# EAGLE design RadioMusic_F rev2-1 (EAGLE 9.0.1)
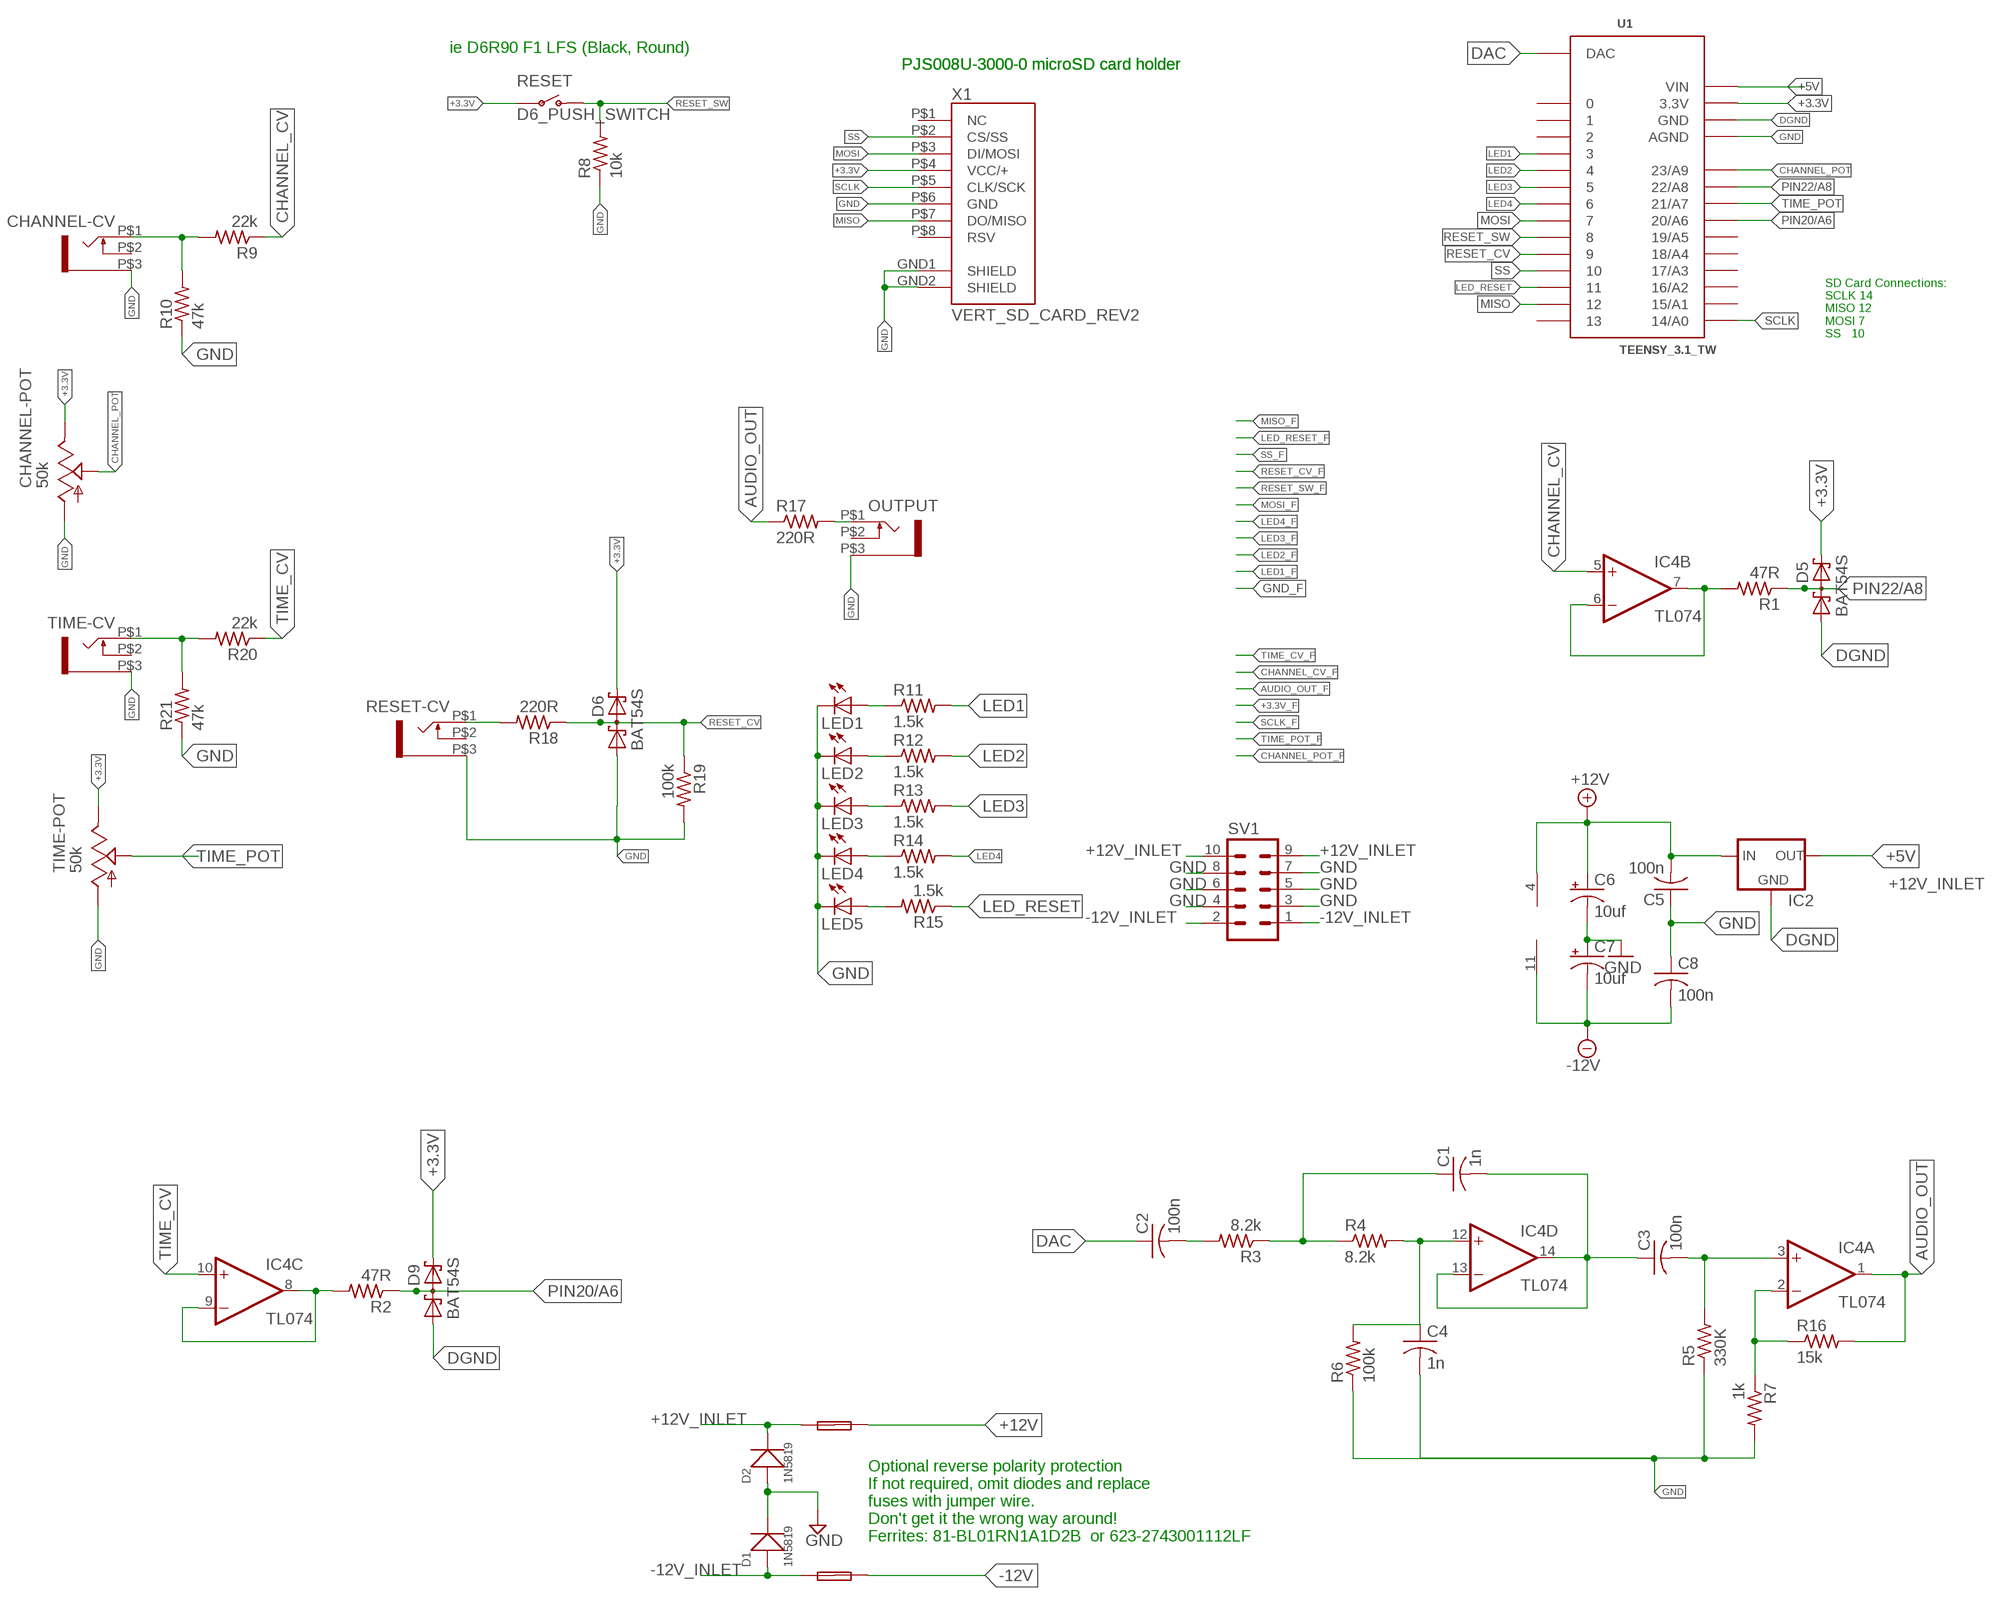
[diagram p0: schematic, sheet 1]

## Parts
C1  1n  C-USC0805  [C0805]
C2  100n  C-USC0805  [C0805]
C3  100n  C-USC0805  [C0805]
C4  1n  C-USC0805  [C0805]
C5  100n  C-USC0805  [C0805]
C6  10uf  CAP_POLPTH2  [CPOL-RADIAL-10UF-25V]
C7  10uf  CAP_POLPTH2  [CPOL-RADIAL-10UF-25V]
C8  100n  C-USC0805  [C0805]
CHANNEL-CV  WQP-PJ301M-12_JACK  [WQP-PJ301M-12_JACK]
CHANNEL-POT  50k  ALPHA-9MMF2A  [EVUF]
D1  1N5819  SMD-DIODE-SCHOTTKY-40V-500MA(SOD-123)  [SOD-123]
D2  1N5819  SMD-DIODE-SCHOTTKY-40V-500MA(SOD-123)  [SOD-123]
D5  BAT54S  [SOT23]
D6  BAT54S  [SOT23]
D9  BAT54S  [SOT23]
F1  FUSE  PTC_FUSEPOLY_FUSE  [C050H075X075]
F2  FUSE  PTC_FUSEPOLY_FUSE  [C050H075X075]
IC2  78LXX  [78LXX]
IC4  TL074  TL074D  [SO14]
LED1  LED3MM  [LED3MM]
LED2  LED3MM  [LED3MM]
LED3  LED3MM  [LED3MM]
LED4  LED3MM  [LED3MM]
LED5  LED3MM  [LED3MM]
OUTPUT  WQP-PJ301M-12_JACK  [WQP-PJ301M-12_JACK]
R1  47R  R-US_R0805  [R0805]
R2  47R  R-US_R0805  [R0805]
R3  8.2k  R-US_R0805  [R0805]
R4  8.2k  R-US_R0805  [R0805]
R5  330K  R-US_R0805  [R0805]
R6  100k  R-US_R0805  [R0805]
R7  1k  R-US_R0805  [R0805]
R8  10k  R-US_R0805  [R0805]
R9  22k  R-US_R0805  [R0805]
R10  47k  R-US_R0805  [R0805]
R11  1.5k  R-US_R0805  [R0805]
R12  1.5k  R-US_R0805  [R0805]
R13  1.5k  R-US_R0805  [R0805]
R14  1.5k  R-US_R0805  [R0805]
R15  1.5k  R-US_R0805  [R0805]
R16  15k  R-US_R0805  [R0805]
R17  220R  R-US_R0805  [R0805]
R18  220R  R-US_R0805  [R0805]
R19  100k  R-US_R0805  [R0805]
R20  22k  R-US_R0805  [R0805]
R21  47k  R-US_R0805  [R0805]
RESET  D6_PUSH_SWITCH  [D6_BUTTON_RND]
RESET-CV  WQP-PJ301M-12_JACK  [WQP-PJ301M-12_JACK]
SV1  10_PIN_HEADER  [MA05-2]
TIME-CV  WQP-PJ301M-12_JACK  [WQP-PJ301M-12_JACK]
TIME-POT  50k  ALPHA-9MMF2A  [EVUF]
U1  TEENSY_3.1_TW  [TEENSY_3.1_TW]
X1  VERT_SD_CARD_REV2  [VERT_MICROSD_REV2]

## Nets
+3.3V: CHANNEL-POT.3(E) D5.2(C2) D6.2(C2) D9.2(C2) RESET.P$3(P) RESET.P$4(P) TIME-POT.3(E) U1.3.3V X1.P$4(VCC/+)
+5V: IC2.OUT U1.VIN
+12V [power]: C5.2 C6.1(+) F1.2 IC2.IN IC4.4(P:V+)
+12V_INLET [power]: D2.- F1.1 SV1.9 SV1.10
-12V [power]: C7.2(-) C8.2 F2.2 IC4.11(P:V-)
-12V_INLET [power]: D1.+ F2.1 SV1.1 SV1.2
AUDIO_OUT: IC4.1(A:OUT) R16.2 R17.1
CHANNEL_CV: IC4.5(B:+IN) R9.1
CHANNEL_POT: CHANNEL-POT.2(S) U1.23/A9
DAC: C2.1 U1.DAC
DGND: D5.1(A1) D9.1(A1) IC2.GND U1.GND
GND [ground]: C4.2 C5.1 C6.2(-) C7.1(+) C8.1 CHANNEL-CV.P$3 CHANNEL-POT.1(A) D1.- D2.+ D6.1(A1) LED1.K(C) LED2.K(C) LED3.K(C) LED4.K(C) LED5.K(C) OUTPUT.P$3 R5.1 R6.1 R7.2 R8.1 R10.1 R19.2 R21.1 RESET-CV.P$3 SV1.3 SV1.4 SV1.5 SV1.6 SV1.7 SV1.8 TIME-CV.P$3 TIME-POT.1(A) U1.AGND X1.GND1(SHIELD) X1.GND2(SHIELD) X1.P$6(GND)
LED1: R11.2 U1.3
LED2: R12.2 U1.4
LED3: R13.2 U1.5
LED4: R14.2 U1.6
LED_RESET: R15.1 U1.11
MISO: U1.12 X1.P$7(DO/MISO)
MOSI: U1.7 X1.P$3(DI/MOSI)
N$1: IC4.6(B:-IN) IC4.7(B:OUT) R1.2
N$2: C4.1 IC4.12(D:+IN) R4.2 R6.2
N$3: OUTPUT.P$1 R17.2
N$4: C1.1 R3.1 R4.1
N$5: C1.2 C3.1 IC4.13(D:-IN) IC4.14(D:OUT)
N$6: C3.2 IC4.3(A:+IN) R5.2
N$7: IC4.2(A:-IN) R7.1 R16.1
N$8: IC4.8(C:OUT) IC4.9(C:-IN) R2.2
N$9: CHANNEL-CV.P$1 R9.2 R10.2
N$10: C2.2 R3.2
N$11: LED2.A R12.1
N$12: LED4.A R14.1
N$13: LED3.A R13.1
N$14: R18.2 RESET-CV.P$1
N$15: LED1.A R11.1
N$16: LED5.A R15.2
PIN20/A6: D9.3(C1A2) R2.1 U1.20/A6
PIN22/A8: D5.3(C1A2) R1.1 U1.22/A8
RESET_CV: D6.3(C1A2) R18.1 R19.1 U1.9
RESET_SW: R8.2 RESET.P$1(O) RESET.P$2(O) U1.8
SCLK: U1.14/A0 X1.P$5(CLK/SCK)
SS: U1.10 X1.P$2(CS/SS)
TEMP: R20.2 R21.2 TIME-CV.P$1
TIME_CV: IC4.10(C:+IN) R20.1
TIME_POT: TIME-POT.2(S) U1.21/A7
Unconnected: CHANNEL-CV.P$2 OUTPUT.P$2 RESET-CV.P$2 TIME-CV.P$2 U1.0 U1.1 U1.2 U1.13 U1.15/A1 U1.16/A2 U1.17/A3 U1.18/A4 U1.19/A5 X1.P$1(NC) X1.P$8(RSV)

## Notes on the sheet
- ie D6R90 F1 LFS (Black, Round)
- PJS008U-3000-0 microSD card holder | PJS008U-3000-0 microSD card holder
- SD Card Connections: 
   SCLK 14
   MISO 12
   MOSI 7 
   SS   10
- Optional reverse polarity protection
  If not required, omit diodes and replace
  fuses with jumper wire. 
  Don't get it the wrong way around! 
  Ferrites: 81-BL01RN1A1D2B  or 623-2743001112LF

## Library data of the parts
C1-C5 C8 = rcl:C-US: CAPACITOR, American symbol; SPICEPREFIX: C
C6 C7 = SparkFun-Passives:CAP_POL: Capacitor Polarized These are standard SMD and PTH capacitors. Normally 10uF, 47uF, and 100uF in electrolytic and tantalum varieties. Always verify the external diameter of the through hole cap, it varies with capacity, voltage, and manufacturer. The EIA devices should be standard.
CHANNEL-CV OUTPUT RESET-CV TIME-CV = thonkiconn:WQP-PJ301M-12_JACK
CHANNEL-POT TIME-POT = TomW:ALPHA-9MM: 9 mm Square Rotary Potentiometers Source: Panasonic
D1 D2 = Seeed-Diode:SMD-DIODE-SCHOTTKY-40V-500MA(SOD-123): 304020012; MPN: B0540W; VALUE: 40V-500MA
D5 D6 D9 = diode:BAT54S: Schottky Diodes Pin connection corrected 2011-05-04 Source: Fairchild .. BAT54.pdf
F1 F2 = TomW:PTC_FUSE
IC2 = v-reg:78LXX: VOLTAGE REGULATOR
IC4 = linear:TL074: OP AMP
LED1-LED5 = TomW:LED: LED OSRAM: - CHIPLED LG R971, LG N971, LY N971, LG Q971, LY Q971, LO R971, LY R971 LH N974, LH R974 LS Q976, LO Q976, LY Q976 LO Q996 - Hyper CHIPLED LW Q18S LB Q993, LB Q99A, LB R99A - SideLED LS A670, LO A670, LY A670, LG A670, LP A670 LB A673, LV A673, LT A673, LW A673 LH A674 LY A675 LS A676, LA A676, LO A676, LY A676, LW A676 LS A679, LY A679, LG A679 - Hyper Micro SIDELED® LS Y876, LA Y876, LO Y876, LY Y876 LT Y87S - SmartLED LW L88C, LW L88S LB L89C, LB L89S, LG L890 LS L89K, LO L89K, LY L89K LS L896, LA L896, LO L896, LY L896 - TOPLED LS T670, LO T670, LY T670, LG T670, LP T670 LSG T670, LSP T670, LSY T670, LOP T670, LYG T670 LG T671, LOG T671, LSG T671 LB T673, LV T673, LT T673, LW T673 LH T674 LS T676, LA T676, LO T676, LY T676, LB T676, LH T676, LSB T676, LW T676 LB T67C, LV T67C, LT T67C, LS T67K, LO T67K, LY T67K, LW E67C LS E67B, LA E67B, LO E67B, LY E67B, LB E67C, LV E67C, LT E67C LW T67C LS T679, LY T679, LG T679 LS T770, LO T770, LY T770, LG T770, LP T770 LB T773, LV T773, LT T773, LW T773 LH T774 LS E675, LA E675, LY E675, LS T675 LS T776, LA T776, LO T776, LY T776, LB T776 LHGB T686 LT T68C, LB T68C - Hyper Mini TOPLED® LB M676 - Mini TOPLED Santana® LG M470 LS M47K, LO M47K, LY M47K Source: http://www.osram.convergy.de LUXEON: - LUMILED® LXK2-PW12-R00, LXK2-PW12-S00, LXK2-PW14-U00, LXK2-PW14-V00 LXK2-PM12-R00, LXK2-PM12-S00, LXK2-PM14-U00 LXK2-PE12-Q00, LXK2-PE12-R00, LXK2-PE12-S00, LXK2-PE14-T00, LXK2-PE14-U00 LXK2-PB12-K00, LXK2-PB12-L00, LXK2-PB12-M00, LXK2-PB14-N00, LXK2-PB14-P00, LXK2-PB14-Q00 LXK2-PR12-L00, LXK2-PR12-M00, LXK2-PR14-Q00, LXK2-PR14-R00 LXK2-PD12-Q00, LXK2-PD12-R00, LXK2-PD12-S00 LXK2-PH12-R00, LXK2-PH12-S00 LXK2-PL12-P00, LXK2-PL12-Q00, LXK2-PL12-R00 Source: www.luxeon.com KINGBRIGHT: KA-3528ASYC Source: www.kingbright.com
R1-R21 = rcl:R-US_: RESISTOR, American symbol; SPICEPREFIX: R
RESET = TomW:D6_PUSH_SWITCH
SV1 = TomW:10_PIN_HEADER: PIN HEADER; OC_FARNELL: unknown; OC_NEWARK: unknown
U1 = TomW:TEENSY_3.1_TW: Basic Teensy 3.0 with none of the 'inner' pins enabled. See '+4', 'AllAnalogPins", and 'AllPins' packages for additional pin holes, as needed.
X1 = TomW:VERT_SD_CARD_REV2

## Net classes
0 default: width 0.203 mm
1 power: width 0.305 mm
2 ground: width 0.305 mm

## Board
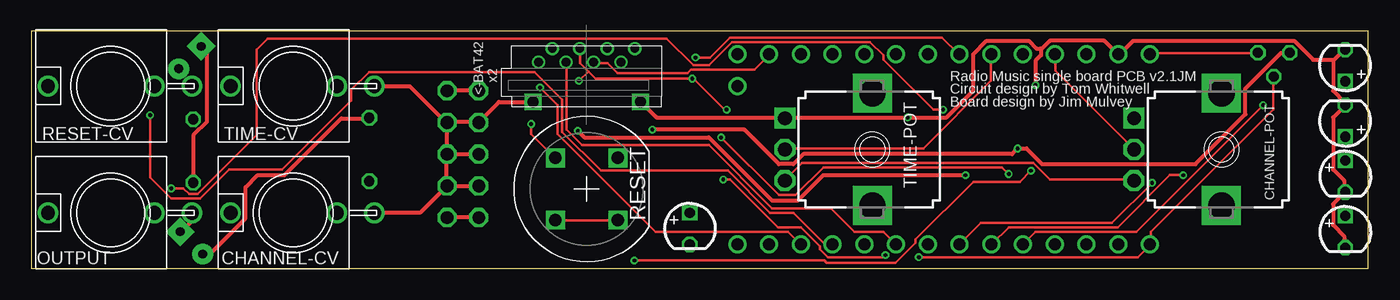
[diagram p1: board, top side]
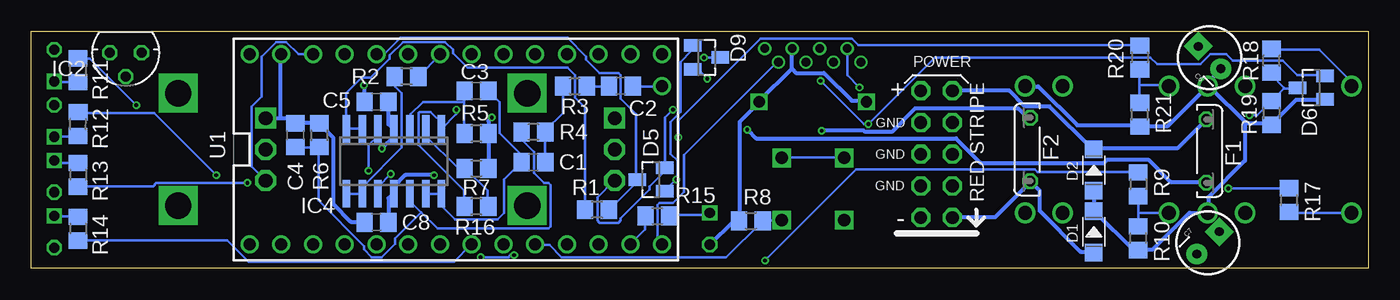
[diagram p2: board, bottom side, seen from below]

Size 107 x 19 mm. Coordinates in mm from the lower left corner, seen from the top.
Outline: 0,19 0,0 107,0 107,19 0,19
Copper layers (1*2*15*16): Top 0.035mm / dielectric 0.2mm / Route2 0.0175mm / dielectric 1.1mm / Route15 0.0175mm / dielectric 0.2mm / Bottom 0.035mm
Design rules "SeeedStudio_DRU_no_angle_20130527": minimum track width 6mil, minimum drill 12mil, track to track 6mil, track to pad 6mil, pad to pad 6mil, via to via 6mil, smd to smd 0mil, copper to edge 10mil, drill to drill 10mil, minimum pad ring 6mil, minimum via ring 6mil, stop-mask expansion 2mil, vias tented up to drill 25mil, thermal gap 10mil

### Footprints (pad centres in the part's own frame; a part is rotated, then mirrored left to right if it is on the bottom)
C0805 = smd 1.3 x 1.5: 1 -0.95,0; 2 0.95,0
CPOL-RADIAL-10UF-25V = drill 0.7 pad 1.651 square: 1 1.27,0 | drill 0.7 pad 1.651: 2 -1.27,0
WQP-PJ301M-12_JACK = drill 1.1: P$1 0,5; P$2 0,-3.5; P$3 0,-6.5
EVUF = drill 1.1 pad 1.676 square: 1 -2.5,-7 | drill 1.1 pad 1.676 octagon: 2 0,-7; 3 2.5,-7 | drill 2.1 pad 2.8 square: M1 4.5,0; M2 -4.5,0
SOD-123 = smd 1.397 x 1.397: + -1.651,0; - 1.651,0
SOT23 = smd 1 x 1.4: 1 -0.95,-1.1; 2 0.95,-1.1; 3 0,1.1
C050H075X075 = drill 0.813 octagon: 1 -2.54,0; 2 2.54,0
78LXX = drill 0.813 octagon: GND 0,1.905; IN 1.27,0; OUT -1.27,0
SO14 = smd 0.6 x 2.2: 1 -3.81,-2.6; 2 -2.54,-2.6; 3 -1.27,-2.6; 4 0,-2.6; 5 1.27,-2.6; 6 2.54,-2.6; 7 3.81,-2.6; 8 3.81,2.6; 9 2.54,2.6; 10 1.27,2.6; 11 0,2.6; 12 -1.27,2.6; 13 -2.54,2.6; 14 -3.81,2.6
LED3MM = drill 0.813 square: A -1.27,0 | drill 0.813 octagon: K 1.27,0
R0805 = smd 1.3 x 1.5: 1 -0.95,0; 2 0.95,0
D6_BUTTON_RND = drill 1 square: P$1 -2.5,2.5; P$2 2.5,2.5; P$3 2.5,-2.5; P$4 -2.5,-2.5
MA05-2 = drill 1.016 octagon: 1 -5.08,-1.27; 2 -5.08,1.27; 3 -2.54,-1.27; 4 -2.54,1.27; 5 0,-1.27; 6 0,1.27; 7 2.54,-1.27; 8 2.54,1.27; 9 5.08,-1.27; 10 5.08,1.27
TEENSY_3.1_TW = drill 0.965: 0 -7.62,13.97; 1 -7.62,11.43; 2 -7.62,8.89; 3 -7.62,6.35; 3.3V 7.62,11.43; 4 -7.62,3.81; 5 -7.62,1.27; 6 -7.62,-1.27; 7 -7.62,-3.81; 8 -7.62,-6.35; 9 -7.62,-8.89; 10 -7.62,-11.43; 11 -7.62,-13.97; 12 -7.62,-16.51; 13 7.62,-16.51; 14/A0 7.62,-13.97; 15/A1 7.62,-11.43; 16/A2 7.62,-8.89; 17/A3 7.62,-6.35; 18/A4 7.62,-3.81; 19/A5 7.62,-1.27; 20/A6 7.62,1.27; 21/A7 7.62,3.81; 22/A8 7.62,6.35; 23/A9 7.62,8.89; AGND 7.62,13.97; DAC 5.08,-16.51; GND -7.62,16.51; VIN 7.62,16.51
VERT_MICROSD_REV2 = drill 0.9 square: GND1 -4.3,-3.17; GND2 4.3,-3.17 | drill 0.7: P$1 -3.85,0; P$2 -2.75,1.1; P$3 -1.65,0; P$4 -0.55,1.1; P$5 0.55,0; P$6 1.65,1.1; P$7 2.75,0; P$8 3.85,1.1

### Placement (x,y rotation side)
C1  66.8,8.51 180 bottom
C2  59.82,14.61 180 bottom
C3  71.37,14.22 180 bottom
C4  85.85,10.67 90 bottom
C5  79.38,13.34 0 bottom
C6  12.7,16.89 135 bottom
C7  12.83,2.03 45 bottom
C8  79.38,3.68 0 bottom
CHANNEL-CV  20.95,4.45 90 top
CHANNEL-POT  95.25,9.53 270 top
D1  21.97,2.92 90 bottom
D2  21.97,7.87 90 bottom
D5  57.4,7.11 90 bottom
D6  4.57,14.48 90 bottom
D9  52.96,16.89 270 bottom
F1  12.95,9.4 270 bottom
F2  27.05,9.53 90 bottom
IC2  99.44,17.27 180 bottom
IC4  77.98,8.58 180 bottom
LED1  105.16,16.26 90 top
LED2  105.16,11.81 90 top
LED3  105.16,7.37 270 top
LED4  105.16,2.92 270 top
LED5  52.7,3.17 270 top
OUTPUT  6.35,4.45 90 top
R1  61.72,4.7 180 bottom
R2  76.96,15.37 180 bottom
R3  63.5,14.61 0 bottom
R4  66.8,10.92 180 bottom
R5  71.37,10.79 180 bottom
R6  83.95,10.67 270 bottom
R7  71.37,8 0 bottom
R8  49.4,3.81 0 bottom
R9  18.41,6.73 270 bottom
R10  18.41,2.41 90 bottom
R11  103.25,15.88 90 bottom
R12  103.25,11.56 89.4 bottom
R13  103.25,7.49 270 bottom
R14  103.25,3.17 270 bottom
R15  56.9,4.19 0 bottom
R16  71.37,4.95 180 bottom
R17  6.35,5.46 270 bottom
R18  7.75,16.64 90 bottom
R19  7.75,12.45 270 bottom
R20  18.29,16.89 270 bottom
R21  18.29,12.32 90 bottom
RESET  44.45,6.35 180 top
RESET-CV  6.35,14.61 90 top
SV1  34.54,9.14 90 bottom
TIME-CV  20.95,14.61 90 top
TIME-POT  67.31,9.53 270 top
U1  73.03,9.53 90 bottom
X1  44.45,16.51 0 top

### Tracks (layer width: path | path; a pad name or v marks a point on that pad's centre or on a via)
+3.3V  (via drill 0.3)
  Top 0.203: v40.01,11.56 40.01,10.76 41.87,8.89 RESET.P$3 | 44.58,15.78 43.92,16.45 43.92,17.6 X1.P$4 | 44.58,15.78 45.16,15.2 v52.9,15.2 52.98,15.2 55.47,12.71 v55.65,12.71 | CHANNEL-POT.3 88.19,7.11 81.52,7.11 80.19,8.45 61.7,8.45 60.36,7.11 TIME-POT.3 | 44.58,15.78 v43.83,15.02
  Bottom 0.203: D6.2 3.56,15.47 5.69,15.47 6.84,16.62 10.85,16.62 11.38,17.16 12.62,17.16 13.42,16.36 16.89,16.36 17.42,16.89 34.67,16.89 v40.01,11.56 40.36,11.56 v43.83,15.02 | RESET.P$4 46.94,8.89 41.96,8.89 RESET.P$3 | U1.3.3V 84.45,17.16 85.61,17.16 86.59,18.14 87.39,18.14 88.54,16.98 88.54,13.78 89.34,12.98 89.34,8.18 88.28,7.11 CHANNEL-POT.3 | TIME-POT.3 60.36,7.02 61.7,5.69 61.7,3.82 61.52,3.65 60.01,3.65 59.83,3.82 59.83,4 57.52,6.31 57.52,6.58 56.36,7.73 56.36,8 D5.2 56.27,8.09 56.27,12.09 v55.65,12.71 | v52.9,15.2 53.61,15.91 54.05,15.91 D9.2
+5V
  Top 0.203: IC2.OUT 98.15,17.25 89.7,17.25 89.61,17.16 U1.VIN
+12V  (via drill 0.3)
  Top 0.305: F1.2 12.98,6.93 12.98,10.67 14.05,11.73 14.05,17.34 C6.1 | IC2.IN 100.64,17.25 100.01,17.25 97.17,14.4 97.17,12.36 93.17,8.36 80.9,8.36 79.65,9.6 v78.94,9.6 78.5,9.16 61.78,9.16 60.98,8.36 59.83,8.36 57.07,11.11 v49.7,11.11
  Bottom 0.305: C5.2 78.41,11.56 78.05,11.2 IC4.4 77.97,11.02 77.97,10.58 v78.94,9.6 | v49.7,11.11 48.98,10.4 32.98,10.4 31.03,8.45 21.16,8.45 20.89,8.71 17.6,8.71 15.82,6.93 12.98,6.93 F1.2
+12V_INLET
  Top 0.305: SV1.10 SV1.9
  Bottom 0.305: F1.1 15.29,9.6 21.96,9.6 D2.- 22.05,9.51 25.51,12.98 27.47,12.98 28.71,14.22 SV1.9
-12V  (via drill 0.3)
  Top 0.305: F2.2 27.03,12 24.8,12 20.27,7.47 18.14,7.47 17.16,6.49 17.16,4 14.31,1.16 13.78,1.16 C7.2 | v74.77,7.47 63.39,7.47 61.34,5.42 59.3,5.42 54.23,10.49 44.27,10.49 v43.74,11.02
  Bottom 0.305: C8.2 78.41,3.73 78.41,5.6 78.05,5.96 IC4.11 77.97,6.13 77.97,6.58 77.08,7.47 v74.77,7.47 | v43.74,11.02 40.36,11.02 40.27,10.94 38.14,10.94 36.27,12.8 28,12.8 27.29,12.09 27.11,12.09 F2.2
-12V_INLET
  Top 0.305: SV1.1 33.34,4.09 35.74,4.09 SV1.2
  Bottom 0.305: D1.+ 22.05,1.33 23.02,1.33 26.31,4.62 26.31,6.22 27.03,6.93 F2.1 27.11,6.84 29.87,4.09 33.25,4.09 SV1.1
AUDIO_OUT  (via drill 0.3)
  Top 0.203: v11.2,6.4 12.18,6.4 12.62,5.96 13.34,5.96 18.05,10.67 18.05,17.51 18.94,18.4 50.85,18.4 52.98,16.27 54.23,16.27 56.1,18.14 67.12,18.14 68.19,17.07 68.19,16.71 72.19,12.71 v72.99,12.71
  Bottom 0.203: v11.2,6.4 6.4,6.4 R17.1 | v72.99,12.71 72.99,12.36 IC4.1 73.97,11.47 75.03,12.54 75.92,12.54 76.01,12.45 76.01,9.87 72.36,6.22 72.36,4.98 R16.2
CHANNEL_CV  (via drill 0.3)
  Top 0.203: v48.27,0.62 63.48,0.62 63.65,0.45 69.16,0.45 70.76,2.04 70.76,2.31 75.39,6.93 79.12,6.93 v80.01,7.82
  Bottom 0.203: v48.27,0.62 40.98,7.91 26.67,7.91 26.49,7.73 18.49,7.73 R9.1 | v80.01,7.82 80.01,9.87 79.3,10.58 79.3,11.11 IC4.5
CHANNEL_POT
  Top 0.203: U1.23/A9 81.97,17.07 81.97,15.82 88.19,9.6 CHANNEL-POT.2
DAC
  Bottom 0.203: C2.1 58.85,14.58 56.54,14.58 U1.DAC
DGND  (via drill 0.3)
  Top 0.203: IC2.GND 99.39,15.29 99.39,12.71 89.61,2.93 89.61,1.96 U1.GND 89.52,1.87 88.54,0.89 v71.03,0.89 | v55.38,7.11 55.92,7.11 59.74,3.29 61.61,3.29 63.12,1.78 63.12,1.51 63.74,0.89 68.19,0.89 v68.36,1.07
  Bottom 0.203: D9.1 54.14,17.78 54.14,17.42 55.03,16.54 55.03,12.54 55.83,11.73 55.83,9.16 55.3,8.62 55.3,7.2 v55.38,7.11 56.27,6.22 D5.1 | v68.36,1.07 68.63,1.07 68.81,0.89 v71.03,0.89
GND  (via drill 0.3)
  Top 0.305: LED4.K 105.08,1.69 105.08,2.58 104.19,3.47 104.19,5.16 105.08,6.04 LED3.K 105.08,6.22 105.08,7.02 104.19,7.91 104.19,12.09 105.08,12.98 LED2.K 105.08,13.16 105.08,13.34 104.19,14.22 104.19,16.62 | 104.19,16.62 105.08,17.51 LED1.K | v80.37,14.67 80.37,16.62 80.81,17.07 80.81,17.51 | 80.81,17.51 81.52,18.22 85.88,18.22 86.94,17.16 U1.AGND 87.12,17.16 88.19,18.22 101.08,18.22 102.59,16.71 104.1,16.71 104.19,16.62 | OUTPUT.P$3 12.8,4.45 12.8,3.73 12,2.93 C7.1 | SV1.3 33.34,6.58 35.74,6.58 SV1.4 | SV1.5 33.25,9.07 33.25,6.76 SV1.3 | SV1.6 35.74,9.16 33.43,9.16 SV1.5 | CHANNEL-CV.P$3 31.11,4.45 SV1.3 | X1.GND1 40.09,13.34 37.43,13.34 35.83,11.73 SV1.8 35.74,11.73 33.34,11.73 SV1.7 | TIME-CV.P$3 27.47,14.58 30.32,14.58 33.16,11.73 SV1.7 | SV1.5 33.25,9.25 33.25,11.56 SV1.7 | X1.GND2 48.81,13.34 50.05,12.09 60.19,12.09 TIME-POT.1 60.36,12.09 v70.14,12.09 73.25,12.09 75.39,14.22 75.39,17.16 76.45,18.22 79.83,18.22 80.45,17.6 80.72,17.6 80.81,17.51
  Bottom 0.305: v80.37,14.67 80.37,13.34 C5.1 | C8.1 80.37,3.73 81.43,3.73 82.86,5.16 82.86,10.49 83.92,11.56 R6.1 84.1,11.65 85.79,11.65 C4.2 85.97,11.65 86.32,12 87.03,12 | 87.03,12 88.19,12 CHANNEL-POT.1 | 87.03,12 87.03,17.07 U1.AGND | D2.+ 21.96,6.22 21.96,4.62 D1.- 21.87,4.53 18.85,1.51 18.49,1.51 R10.1 18.31,1.51 17.25,1.51 14.31,4.45 OUTPUT.P$3 12.8,4.53 12.8,5.69 9.87,8.62 9.87,11.56 9.78,11.65 | D6.1 3.56,13.51 5.78,13.51 7.73,11.56 R19.2 7.82,11.65 9.78,11.65 | RESET-CV.P$3 12.89,14.58 16.09,11.38 18.22,11.38 R21.1 18.4,11.47 23.29,11.47 26.4,14.58 27.38,14.58 TIME-CV.P$3 | C6.2 11.82,15.91 12.89,14.85 12.89,14.76 RESET-CV.P$3 | 9.78,11.65 12.71,14.58 RESET-CV.P$3 | R7.2 70.41,10.76 R5.1 70.41,10.94 70.41,11.82 v70.14,12.09 | LED5.K 52.63,1.96 50.85,3.73 50.41,3.73 R8.1 50.32,3.91 50.32,11.73 48.81,13.25 X1.GND2 48.72,13.42 46.14,16 | 46.14,16 46.14,17.6 X1.P$6 | 46.14,16 45.78,15.65 43.56,15.65 41.34,13.42 40.18,13.42 X1.GND1
LED1  (via drill 0.3)
  Top 0.203: v98.59,13.07 88.46,2.93 80.37,2.93 79.39,1.96 U1.3
  Bottom 0.203: v98.59,13.07 102.32,16.8 103.21,16.8 R11.2
LED2  (via drill 0.3)
  Top 0.203: v92.19,7.47 91.12,7.47 86.94,3.29 78.23,3.29 76.9,1.96 U1.4
  Bottom 0.203: v92.19,7.47 97.17,12.45 103.21,12.45 R12.2
LED3  (via drill 0.3)
  Top 0.203: v89.7,6.84 86.5,3.65 76.01,3.65 74.32,1.96 U1.5
  Bottom 0.203: v89.7,6.84 96.99,6.84 97.26,6.58 103.21,6.58 R13.2
LED4
  Bottom 0.203: R14.2 103.21,2.22 91.3,2.22 89.61,0.53 73.17,0.53 71.83,1.87 U1.6
LED_RESET
  Bottom 0.203: R15.1 57.87,4.18 57.87,3.11 59.03,1.96 U1.11
MISO
  Bottom 0.203: X1.P$7 47.21,16.45 47.38,16.45 54.76,9.07 54.76,6.13 55.65,5.25 56.72,5.25 56.9,5.07 56.9,2.31 56.54,1.96 U1.12
MOSI
  Top 0.203: U1.7 68.19,2.93 65.88,2.93 64.01,4.8 59.3,4.8 54.23,9.87 44.09,9.87 42.85,11.11 42.85,16.45 X1.P$3
N$1
  Bottom 0.203: R1.2 62.67,4.71 62.67,12.89 63.48,13.69 63.48,15.47 64.1,16.09 72.1,16.09 73.25,17.25 73.25,17.51 73.88,18.14 77.25,18.14 78.32,17.07 78.32,16.8 79.83,15.29 80.54,15.29 81.79,14.05 IC4.7 81.7,11.2 80.54,11.2 IC4.6
N$2
  Bottom 0.203: C4.1 85.79,9.69 84.01,9.69 R6.2 84.01,9.6 84.01,5.42 80.37,1.78 80.37,1.51 79.74,0.89 78.94,0.89 77.88,1.96 77.88,2.4 75.79,4.49 | 75.79,4.49 76.63,5.33 76.63,5.96 IC4.12 | 75.79,4.49 74.5,3.2 65.61,3.2 65.43,3.38 65.43,6.67 65.61,6.84 65.96,6.84 66.76,7.64 66.76,9.34 67.74,10.31 67.74,10.85 R4.2
N$3
  Bottom 0.203: OUTPUT.P$1 6.31,4.45 R17.2
N$4
  Bottom 0.203: C1.1 65.88,8.53 65.88,10.85 R4.1 65.88,11.02 64.45,12.45 64.45,14.58 R3.1
N$5
  Bottom 0.203: IC4.13 75.39,5.96 74.23,5.96 IC4.14 74.23,5.87 74.23,5.07 73.08,3.91 69.7,3.91 69.16,4.45 69.16,7.11 67.83,8.45 C1.2 67.83,8.53 67.83,9.16 69.52,10.85 69.52,13.34 C3.1
N$6
  Bottom 0.203: 72.36,13.34 72.36,14.22 C3.2 | 72.36,13.34 72.36,10.85 R5.2 | 72.36,13.34 75.65,13.34 76.63,12.36 76.63,11.2 IC4.3
N$7
  Bottom 0.203: R16.1 70.5,4.98 70.5,6.22 72.28,8 R7.1 72.36,8.09 72.9,8.09 75.39,10.58 75.39,11.11 IC4.2
N$8
  Bottom 0.203: R2.2 77.88,15.29 77.88,14.58 77.34,14.05 77.34,9.69 80.45,6.58 80.45,6.04 IC4.9 80.54,5.96 81.79,5.96 IC4.8
N$9
  Bottom 0.203: 18.4,4.45 R9.2 | 18.4,4.45 18.4,3.38 R10.2 | CHANNEL-CV.P$1 18.4,4.45
N$10
  Bottom 0.203: C2.2 60.81,14.58 62.5,14.58 R3.2
N$11
  Bottom 0.203: R12.1 103.3,10.58 105.08,10.58 LED2.A
N$12
  Bottom 0.203: R14.1 103.3,4.18 105.08,4.18 LED4.A
N$13
  Bottom 0.203: R13.1 103.3,8.45 104.9,8.45 105.08,8.62 LED3.A
N$14
  Bottom 0.203: R18.2 7.73,17.51 3.91,17.51 1.42,15.02 1.42,14.67 RESET-CV.P$1
N$15
  Bottom 0.203: R11.1 103.3,14.94 105.08,14.94 LED1.A
N$16
  Bottom 0.203: R15.2 55.92,4.27 52.9,4.27 52.72,4.45 LED5.A
PIN20/A6  (via drill 0.3)
  Top 0.203: v53.16,16.89 54.32,16.89 55.92,18.49 72.9,18.49 74.23,17.16 U1.20/A6
  Bottom 0.203: v53.16,16.89 D9.3 | R2.1 74.32,17.07 U1.20/A6
PIN22/A8
  Bottom 0.203: R1.1 60.72,4.71 58.59,6.84 58.59,7.11 D5.3 58.59,7.2 58.59,12.36 59.83,13.6 59.83,15.47 60.01,15.65 61.52,15.65 62.59,16.71 62.59,16.98 64.1,18.49 77.43,18.49 78.77,17.16 79.3,17.16 U1.22/A8
RESET_CV  (via drill 0.3)
  Top 0.203: v9.51,12.27 9.51,7.29 11.2,5.6 13.51,5.6 15.82,7.91 20.09,7.91 25.6,13.42 25.6,14.31 27.03,15.73 40.27,15.73 42.49,13.51 42.49,10.94 45.61,7.82 55.74,7.82 59.12,4.45 60.98,4.45 63.48,1.96 64.1,1.96 U1.9
  Bottom 0.203: 6.76,14.4 5.69,14.4 D6.3 | 6.76,14.4 7.73,13.42 R19.1 7.82,13.34 8.89,12.27 v9.51,12.27 | R18.1 7.73,15.65 7.73,15.47 6.76,14.49 6.76,14.4
RESET_SW
  Top 0.203: RESET.P$2 41.96,3.82 46.94,3.82 RESET.P$1
  Bottom 0.203: RESET.P$1 47.03,3.82 48.45,3.82 R8.2 48.54,3.73 51.38,0.89 64.54,0.89 65.52,1.87 66.67,1.87 U1.8
SCLK
  Top 0.203: X1.P$5 45.07,16.45 46.14,16.45 46.94,15.65 52.54,15.65 52.81,15.91 57.87,15.91 59.03,17.07 U1.14/A0
SS  (via drill 0.3)
  Top 0.203: v40.72,14.49 42.14,13.07 42.14,10.76 49.96,2.93 60.54,2.93 61.52,1.96 U1.10
  Bottom 0.203: v40.72,14.49 41.69,15.47 X1.P$2
TEMP
  Bottom 0.203: 18.31,14.67 18.31,15.91 R20.2 | 18.31,14.67 18.31,13.34 R21.2 | 18.31,14.67 16,14.67 TIME-CV.P$1
TIME_CV  (via drill 0.3)
  Top 0.203: v55.21,10.49 59.83,5.87 61.16,5.87 63.39,8.09 77.7,8.09 v78.23,7.56
  Bottom 0.203: v55.21,10.49 55.21,11.82 48.63,18.4 41.34,18.4 40.8,17.87 18.31,17.87 R20.1 | v78.23,7.56 79.21,6.58 79.21,6.04 IC4.10
TIME_POT
  Top 0.203: U1.21/A7 76.81,17.07 76.81,15.02 71.39,9.6 60.36,9.6 TIME-POT.2

### Text on the board
tPlace: <-BAT42 / x2 | Radio Music single board PCB v2.1JM / Circuit design by Tom Whitwell / Board design by Jim Mulvey